# EAGLE design uCoNoPcb (EAGLE 5.11)
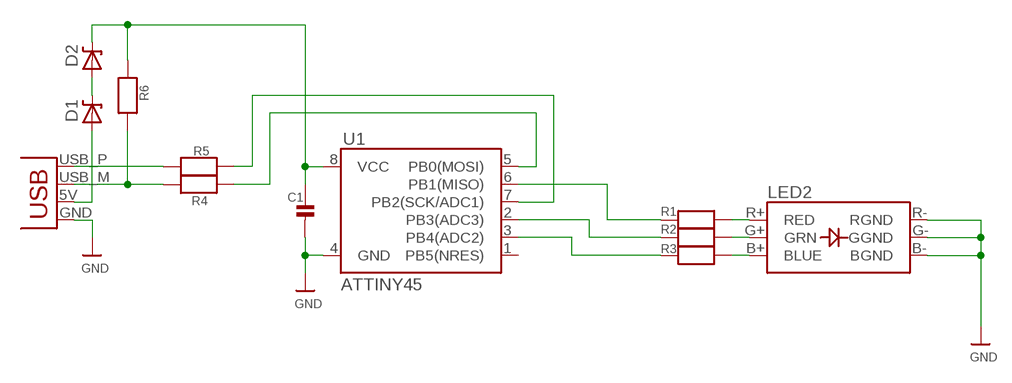
[diagram p0: schematic, sheet 1]

## Parts
C1  CAP_CERAMIC0603  [0603]
D1  DIODE-ZENER-BZT52  [SOD-323]
D2  DIODE-ZENER-BZT52  [SOD-323]
LED2  LED_RGB_PLCC6  [RGBLED_PLCC6]
R1  RESISTOR0603  [0603]
R2  RESISTOR0603  [0603]
R3  RESISTOR0603  [0603]
R4  RESISTOR0603  [0603]
R5  RESISTOR0603  [0603]
R6  RESISTOR0603  [0603]
U1  ATTINY45  [SO08-EIAJ]
X1  USBPCB  [USB-A-PCB]

## Nets
3V: C1.1 D2.1(C) R6.2 U1.8(VCC)
5V: D1.2(A) X1.5V(VBUS)
BLUE: R3.1 U1.3(PB4(ADC2))
BLUEA: LED2.B+(BLUE) R3.2
D+: R5.1 X1.USB_P(D+)
D-: R4.1 R6.1 X1.USB_M(D-)
DATA+: R5.2 U1.7(PB2(SCK/ADC1))
DATA-: R4.2 U1.5(PB0(MOSI))
GND: C1.2 LED2.B-(BGND) LED2.G-(GGND) LED2.R-(RGND) U1.4(GND) X1.GND
GREEN: R2.1 U1.2(PB3(ADC3))
GREENA: LED2.G+(GRN) R2.2
N$2: D1.1(C) D2.2(A)
RED: R1.1 U1.6(PB1(MISO))
REDA: LED2.R+(RED) R1.2
Unconnected: U1.1(PB5(NRES))

## Library data of the parts
C1 = microbuilder:CAP_CERAMIC: Ceramic Capacitors 0402 - 0402 Surface Mount Capacitors 0.1uF 10V 10% [Digikey: 490-1318-2-ND] 0603 - 0603 Surface Mount Capacitors 16 pF 50V 5% [Digikey: 445-5051-2-ND] 22 pF 50V [Digikey: PCC220ACVTR-ND] 33 pF 50V 5% [Digikey: 490-1415-1-ND] 56pF 50V 5% [Digikey: 490-1421-1-ND] 220pF 50V 5% [Digikey: 445-1285-1-ND] 680 pF 50V 2200 pF 50V 5% C0G [Digikey: 445-1297-1-ND] 5600 pF 100V 5% X7R [Digikey: 478-3711-1-ND] 0.1 µF 25V 10% [Digikey: PCC2277TR-ND] 0.22 µF 16V 10% X7R [Digikey: 445-1318-1-ND] 1.0 µF 25V 10% [Digikey: 445-5146-2-ND] 0603 - RF Specific 3pF 250V +/-0.1pF RF [Digikey: 712-1347-1-ND] 18 pF 250V 5% [Digikey: 478-3505-1-ND or 712-1322-1-ND] 56 pF 250V 5% C0G RF [Digikey: 490-4867-1-ND] 68 pF 250V RF [Digikey: 490-4868-1-ND] 0805 - 0805 Surface Mount Capacitors 220 pF 250V 2% RF Ceramic Capacitor [Digikey: 712-1398-1-ND] 1000 pF 50V 2% NP0 Ceramic Capacitor [Digikey: 478-3760-1-ND] 0.1 µF 25V 10% Ceramic Capacitor [Digikey: PCC1828TR-ND] 1.0 µF 16V 10% Ceramic Capacitor[Digikey: 490-1691-2-ND] 10.0 µF 10V 10% Ceramic Capacitor[Digikey: 709-1228-1-ND] 1206 - 1206 Surface Mount Capacitors
D1 D2 = SparkFun:DIODE-ZENER: Zener Diode Production Part - 8199 3.4V Zener Voltage
LED2 = microbuilder:LED_RGB_PLCC6: RGB LED Red, Green and Blue LED - PLCC-6 DC Foreward Current: 100mA Foreward Voltage: R = 2.0, G = 3.4, B = 3.6 Viewing Angle: 140°
R1-R6 = microbuilder:RESISTOR: Resistors 0402 - 0402 Surface Mount Package 10.0K 1% 1/16W [Digikey: 311-10.0KLRTR-ND] 0603 - 0603 Surface Mount Package 0 Ohm 1/10 Watt 1% Resistor 15 Ohm 1/10 Watt 1% Resistor 33 Ohm 1/10 Watt 1% Resistor 49.9 Ohm 1/10 Watt 1% Resistor 100 Ohm 1/10 Watt 1% Resistor 150 Ohm 1/10 Watt 1% Resistor 240 Ohm 1/10 Watt 1% Resistor 390 Ohm 1/10 Watt 1% Resistor 560 Ohm 1/10 Watt 1% Resistor 750 Ohm 1/10 Watt 1% Resistor 1.0K Ohm 1/10 Watt 1% Resistor 1.5K Ohm 1/10 Watt 1% Resistor 2.0K Ohm 1/10 Watt 1% Resistor 4.7K Ohm 1/10 Watt 1% Resistor 10.0K Ohm 1/10 Watt 1% Resistor 20.0K Ohm 1/10 Watt 1% Resistor 33.0K Ohm 1/10 Watt 1% Resistor 100.0K Ohm 1/10 Watt 1% Resistor 0805 - 0805 Surface Mount Package 0 Ohm 1/8 Watt 1% Resistor 33 Ohm 1/8 Watt 1% Resistor 100 Ohm 1/8 Watt 1% Resistor 150 Ohm 1/8 Watt 1% Resistor 200 Ohm 1/8 Watt 1% Resistor 240 Ohm 1/8 Watt 1% Resistor 330 Ohm 1/8 Watt 1% Resistor 390 Ohm 1/8 Watt 1% Resistor 470 Ohm 1/8 Watt 1% Resistor 1.0K Ohm 1/8 Watt 1% Resistor 1.5K Ohm 1/8 Watt 1% Resistor 2.0K Ohm 1/8 Watt 1% Resistor 4.7K Ohm 1/8 Watt 1% Resistor 5.1K Ohm 1/8 Watt 1% Resistor 5.6K Ohm 1/8 Watt 1% Resistor 10.0K Ohm 1/8 Watt 1% Resistor 22.0K Ohm 1/8 Watt 1% Resistor 33.0K Ohm 1/8 Watt 1% Resistor 100K Ohm 1/8 Watt 1% Resistor 1206 - 1206 Surface Mount Package
U1 = SparkFun:ATTINY45: Atmel ATTiny45
X1 = SparkFun:USB: USB Connectors USB-B-PTH is fully proven SKU : PRT-00139 USB-miniB is fully proven SKU : PRT-00587 USB-A-PCB is untested. USB-A-H is throughly reviewed, but untested. Spark Fun Electronics SKU : PRT-00437 USB-B-SMT is throughly reviewed, but untested. Needs silkscreen touching up. USB-A-S has not been used/tested USB-MB-H has not been used/tested

## Net classes
0 default: width 0.229 mm, drill 0.305 mm, clearance 0.229 mm

## Board
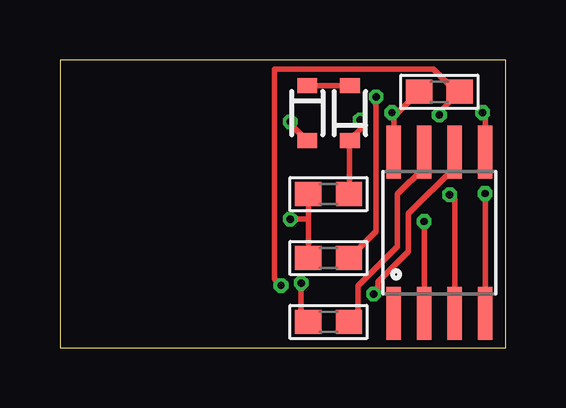
[diagram p1: board, top side]
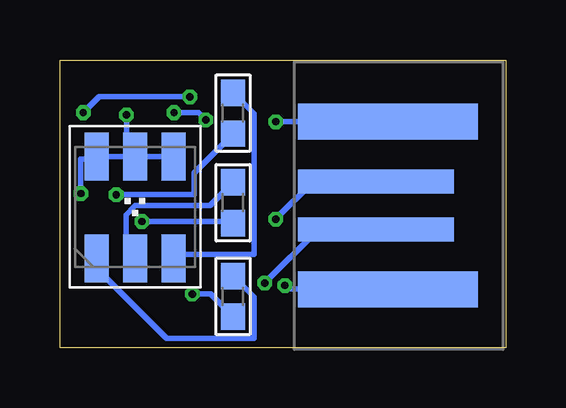
[diagram p2: board, bottom side, seen from below]

Size 18.6 x 12 mm. Coordinates in mm from the lower left corner, seen from the top.
Outline: 0,0 18.6,0 18.6,12 0,12 0,0
Copper layers (1*16): Top 0.035mm / dielectric 1.5mm / Bottom 0.035mm
Design rules "Fusion_eagle_rule_v1.1": minimum track width 6mil, minimum drill 12mil, track to track 6mil, track to pad 6mil, pad to pad 6mil, via to via 6mil, smd to smd 0mil, copper to edge 10mil, drill to drill 10mil, minimum pad ring 10mil, minimum via ring 6mil, stop-mask expansion 2mil, vias tented up to drill 100mil, thermal gap 10mil
tRestrict: area 0,0 to 8.7,11.9
bRestrict: area 0,0 to 4.4,11.9
vRestrict: area 0,0 to 8.7,11.9

### Footprints (pad centres in the part's own frame; a part is rotated, then mirrored left to right if it is on the bottom)
0603 = smd 1.1 x 1: 1 -0.85,0; 2 0.85,0
SOD-323 = smd 0.63 x 0.83: 1 -1.15,0; 2 1.15,0
RGBLED_PLCC6 = smd 1 x 2: B+ 1.6,-2.158; B- 1.6,2.108; G+ 0,-2.158; G- 0,2.108; R+ -1.6,-2.158; R- -1.6,2.108
SO08-EIAJ = smd 0.61 x 2.21: 1 -1.905,-3.378; 2 -0.635,-3.378; 3 0.635,-3.378; 4 1.905,-3.378; 5 1.905,3.353; 6 0.635,3.353; 7 -0.635,3.353; 8 -1.905,3.353
USB-A-PCB = smd 7.5 x 1.5: 5V -0.2,-3.5; GND -0.2,3.5 | smd 6.5 x 1: USB_M 0.3,-1; USB_P 0.3,1

### Placement (x,y rotation side)
C1  15.82,10.67 0 top
D1  10.31,9.78 270 top
D2  12.09,9.78 90 top
LED2  15.47,5.87 0 bottom
R1  11.38,2.13 90 bottom
R2  11.38,6.05 90 bottom
R3  11.38,9.78 90 bottom
R4  11.2,3.73 0 top
R5  11.2,1.07 0 top
R6  11.2,6.4 0 top
U1  15.82,4.8 0 top
X1  5.12,5.92 180 bottom

### Tracks (layer width: path | path; a pad name or v marks a point on that pad's centre or on a via)
3V  (via drill 0.3)
  Top 0.229: R6.2 12.06,6.4 12.06,8.59 12.09,8.61 D2.1 12.14,8.74 12.52,9.12 v12.52,9.5 | 13.97,9.68 13.92,9.63 U1.8 | 13.97,9.68 C1.1 | v13.84,9.8 13.97,9.68
  Bottom 0.229: v12.52,9.5 12.83,9.8 v13.84,9.8
5V  (via drill 0.3)
  Top 0.229: v9.6,9.42 9.6,9.35 D1.2
  Bottom 0.229: v9.6,9.42 X1.5V
BLUE  (via drill 0.3)
  Top 0.229: v16.26,6.38 16.46,6.17 U1.3
  Bottom 0.229: v16.26,6.38 13.01,6.38 13.01,7.29 11.38,8.91 R3.1
BLUEA
  Bottom 0.229: R3.2 11.38,10.62 10.52,9.75 10.52,3.89 13.72,3.89 13.87,3.73 LED2.B+
D+  (via drill 0.3)
  Top 0.229: v10.06,2.69 10.06,1.35 10.34,1.07 R5.1
  Bottom 0.229: v10.06,2.69 7.85,4.9 5.44,4.9 X1.USB_P
D-  (via drill 0.3)
  Top 0.229: 10.36,5.36 10.36,6.4 R6.1 | 10.36,5.36 10.36,3.73 R4.1 | v9.6,5.36 10.36,5.36
  Bottom 0.229: v9.6,5.36 8.05,6.91 5.44,6.91 X1.USB_M
DATA+
  Top 0.229: U1.7 15.19,7.52 14.07,6.4 14.07,4.22 12.42,2.56 12.42,1.42 12.06,1.07 R5.2
DATA-  (via drill 0.3)
  Top 0.229: v13.18,10.46 13.18,4.85 12.06,3.73 R4.2 | v17.63,9.8 17.73,9.7 U1.5
  Bottom 0.229: v13.18,10.46 16.97,10.46 v17.63,9.8
GND  (via drill 0.3)
  Top 0.229: v15.82,9.7 15.82,9.83 C1.2 16.51,10.67 15.57,11.61 8.94,11.61 8.94,2.87 v9.22,2.59 | v17.73,6.43 U1.4
  Bottom 0.229: v15.82,9.7 15.82,7.98 LED2.G- | LED2.B- 13.89,7.98 15.37,7.98 LED2.G- | LED2.G- 15.93,7.98 17.04,7.98 LED2.R- 17.12,7.87 17.73,7.87 v17.73,6.43 | v9.22,2.59 9.07,2.44 4.93,2.44 X1.GND
GREEN  (via drill 0.3)
  Top 0.229: U1.2 v15.19,5.26
  Bottom 0.229: v15.19,5.26 11.43,5.26 R2.1
GREENA
  Bottom 0.229: R2.2 11.38,6.88 12.34,5.92 15.47,5.92 15.85,5.54 15.85,3.73 15.47,3.73 LED2.G+
N$2
  Top 0.229: D1.1 D2.2
RED  (via drill 0.3)
  Top 0.229: v13.08,2.23 13.26,2.41 13.26,2.74 14.53,4.01 14.53,5.59 16.46,7.52 U1.6
  Bottom 0.229: v13.08,2.23 12.32,2.23 11.38,1.29 R1.1
REDA
  Bottom 0.229: R1.2 10.52,2.11 10.52,0.38 14.15,0.38 17.04,3.28 17.04,3.71 LED2.R+